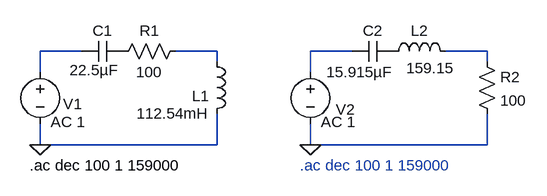
[diagram p0: schematic Taller9_Reto.asc]
Taller9_Reto.asc, the LTspice schematic file:
Version 4.1
SHEET 1 1104 680
WIRE 32 96 -32 96
WIRE 240 96 176 96
WIRE 448 96 384 96
WIRE 656 96 592 96
WIRE 240 112 240 96
WIRE 656 112 656 96
WIRE -32 128 -32 96
WIRE 384 128 384 96
WIRE -32 240 -32 208
WIRE 240 240 240 192
WIRE 240 240 -32 240
WIRE 384 240 384 208
WIRE 656 240 656 192
WIRE 656 240 384 240
FLAG -32 240 0
FLAG 384 240 0
SYMBOL voltage -32 112 R0
WINDOW 123 16 93 Left 2
WINDOW 39 0 0 Left 0
WINDOW 0 35 65 Left 2
SYMATTR Value2 AC 1
SYMATTR InstName V1
SYMATTR Value ""
SYMBOL voltage 384 112 R0
WINDOW 123 16 93 Left 2
WINDOW 39 0 0 Left 0
WINDOW 0 39 74 Left 2
SYMATTR Value2 AC 1
SYMATTR InstName V2
SYMATTR Value ""
SYMBOL cap 96 80 R90
WINDOW 0 0 32 VBottom 2
WINDOW 3 29 45 VTop 2
SYMATTR InstName C1
SYMATTR Value 22.5µF
SYMBOL res 192 80 R90
WINDOW 0 0 56 VBottom 2
WINDOW 3 32 56 VTop 2
SYMATTR InstName R1
SYMATTR Value 100
SYMBOL ind 224 96 R0
WINDOW 0 -22 69 Left 2
WINDOW 3 -108 96 Left 2
SYMATTR InstName L1
SYMATTR Value 112.54mH
SYMBOL cap 512 80 R90
WINDOW 0 0 32 VBottom 2
WINDOW 3 32 52 VTop 2
SYMATTR InstName C2
SYMATTR Value 15.915µF
SYMBOL ind 496 112 R270
WINDOW 0 32 56 VTop 2
WINDOW 3 6 73 VBottom 2
SYMATTR InstName L2
SYMATTR Value 159.15
SYMBOL res 640 96 R0
SYMATTR InstName R2
SYMATTR Value 100
TEXT -48 272 Left 2 !.ac dec 100 1 159000
TEXT 368 272 Left 2 ;.ac dec 100 1 159000

The netlist it stands for:
* Taller9_Reto.asc
V1 N001 0 AC 1
V2 N003 0 AC 1
C1 P001 N001 22.5µF
R1 N002 P001 100
L1 N002 0 112.54mH
C2 P002 N003 15.915µF
L2 P002 N004 159.15
R2 N004 0 100
.ac dec 100 1 159000
* .ac dec 100 1 159000
.backanno
.end